# Altium schematic sheet SCH_MODULO_LORA.SchDoc
size A4
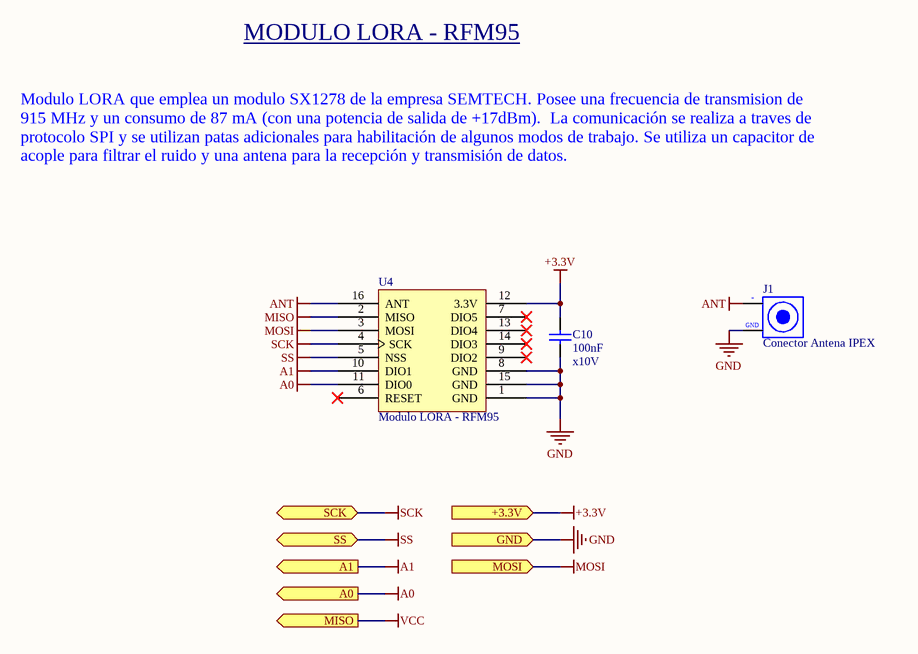
[diagram p0: SCH_MODULO_LORA.SchDoc]

## Parts
C10  value 100nF  Voltage: x10V  [RAD-0.3]  (hidden comment: Capacitor - Común)
J1  Conector Antena IPEX
U4  Modulo LORA - RFM95

## Ports
+3.3V (in), A0 (out), A1 (out), GND (in), MISO (out), MOSI (in), SCK (bidir), SS (bidir)

## Nets
+3.3V: C10.2 U4.12(3.3V) ; port +3.3V
A0: U4.11(DIO0) ; port A0
A1: U4.10(DIO1) ; port A1
ANT: J1.1(ANT) U4.16(ANT)
GND: C10.1 J1.2 U4.1(GND) U4.8(GND) U4.15(GND) ; port GND
MISO: U4.2(MISO)
MOSI: U4.3(MOSI) ; port MOSI
SCK: U4.4(SCK) ; port SCK
SS: U4.5(NSS) ; port SS
VCC: port MISO

Not connected (* = marked no-connect by the designer): U4 6(RESET)* 7(DIO5)* 9(DIO2)* 13(DIO4)* 14(DIO3)*

## Notes on the sheet
- MODULO LORA - RFM95
- Modulo LORA que emplea un modulo SX1278 de la empresa SEMTECH. Posee una frecuencia de transmision de 915 MHz y un consumo de 87 mA (con una potencia de salida de +17dBm).  La comunicación se realiza a traves de protocolo SPI y se utilizan patas adicionales para habilitación de algunos modos de trabajo. Se utiliza un capacitor de acople para filtrar el ruido y una antena para la recepción y transmisión de datos.
- 27/06/20
- Fecha
- Cambio Formulario
- Emision Inicial
- Versión
- 00
- Producto
- Código
- Cambio Circuito Eléctrico
- CI N°
- Nivel
- UBM:
- Revisó
- Cód. Formulario
- Realizó
- 1
- PF-ID-014-P
- Aprobó
- Vigencia
- COPIA NO CONTROLADA AL IMPRIMIR
- 15/05/2016
- A4
- Cargo
- 1/1
- (in symbol Conector Antena IPEX) +; GND

## Library data of the parts
C10 = Capacitor - Común: Capacitor; Published: 8-Jun-2000; LatestRevisionDate: 17-Jul-2002; LatestRevisionNote: Re-released for DXP Platform.; PackageReference: RAD-0.3; Publisher: Altium Limited; PackageDescription: Radial Cap, Thru-Hole; 2 Leads; 0.3 in Pin Spacing
J1 = Conector Antena IPEX: IPEX MHF3
U4 = Modulo LORA - RFM95: RFM95-915-S2